# Altium schematic sheet Sheet2.SchDoc
size A3
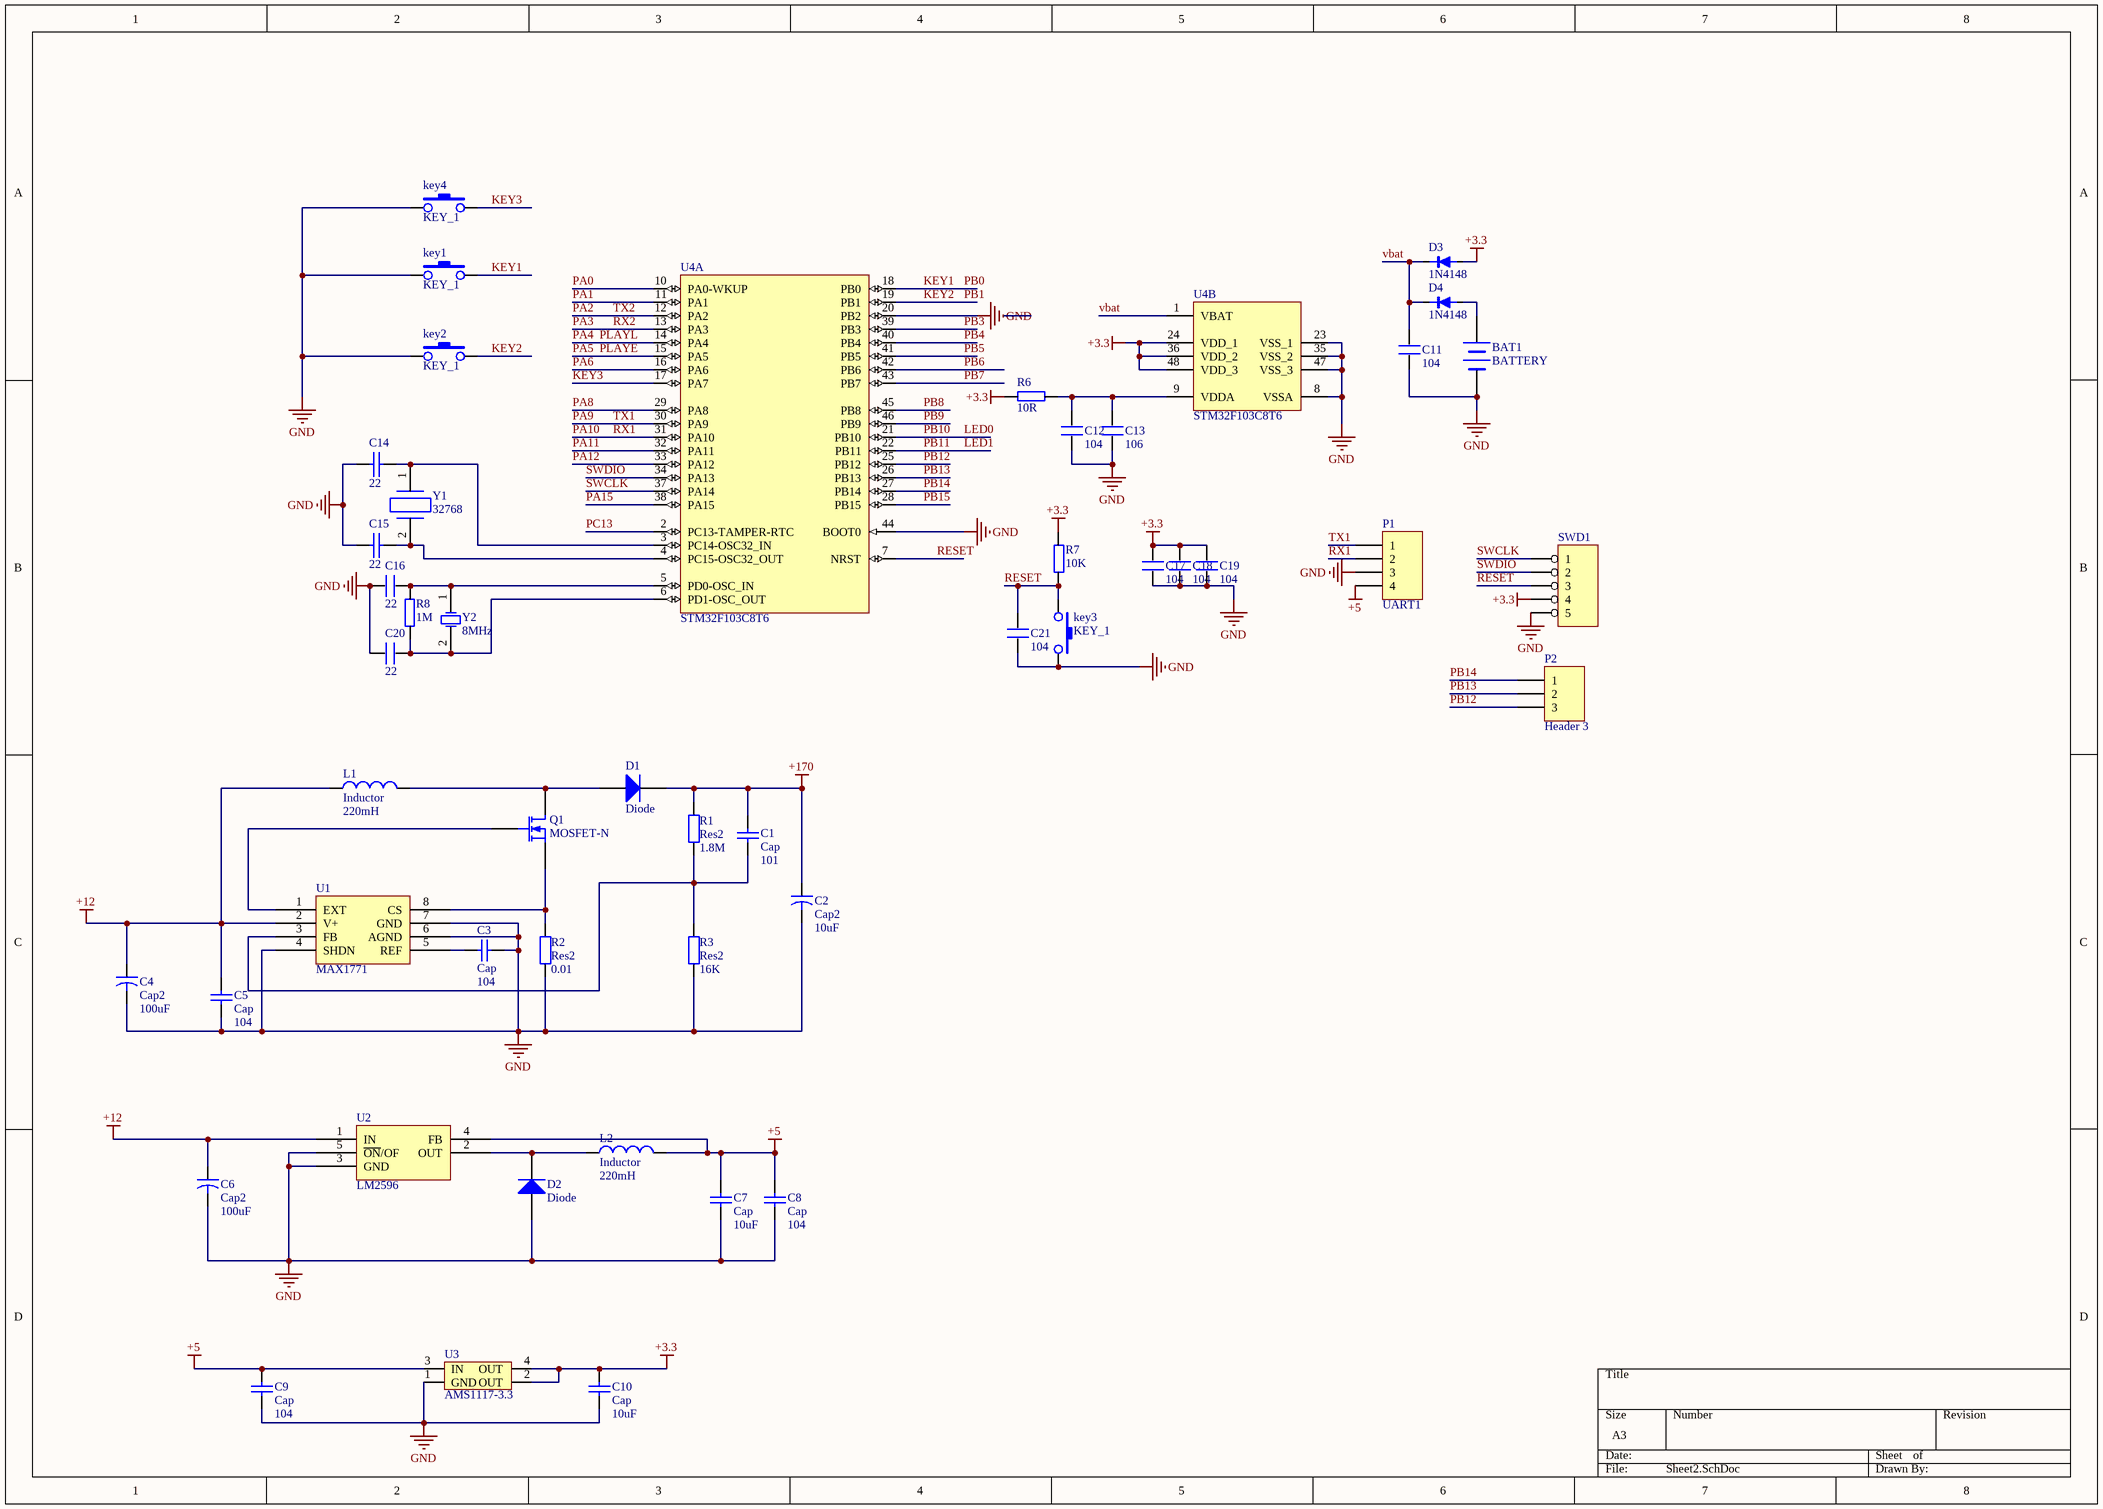
[diagram p0: Sheet2.SchDoc]

## Parts
BAT1  BATTERY  [CR1220]
C1  Cap  value 101  [1206C]
C2  Cap2  value 10uF  [C10x16]
C3  Cap  value 104  [0805-0c]
C4  Cap2  value 100uF  [C5X8]
C5  Cap  value 104  [0805-0c]
C6  Cap2  value 100uF  [C5X8]
C7  Cap  value 10uF  [0805-0c]
C8  Cap  value 104  [0805-0c]
C9  Cap  value 104  [0805-0c]
C10  Cap  value 10uF  [0805-0c]
C11  104  [0805-0c]
C12  104  [0805-0c]
C13  106  [0805-0c]
C14  22  [0805-0c]
C15  22  [0805-0c]
C16  22  [0805-0c]
C17  104  [0805-0c]
C18  104  [0805-0c]
C19  104  [0805-0c]
C20  22  [0805-0c]
C21  104  [0805-0c]
D1  Diode  [DO-214]
D2  Diode  [DO-214]
D3  1N4148  [DO-214]
D4  1N4148  [DO-214]
key1  KEY_1  [KEY-DIP4W]
key2  KEY_1  [KEY-DIP4W]
key3  KEY_1  [KEY-SMD1]
key4  KEY_1  [KEY-DIP4W]
L1  Inductor  value 220mH  [L7X7]
L2  Inductor  value 220mH  [L7X7]
P1  UART1  [HDR1X4]
P2  Header 3  [HDR1X3]
Q1  MOSFET-N  [TO-263-3]
R1  Res2  value 1.8M  [0805-0r]
R2  Res2  value 0.01  [0805-0r]
R3  Res2  value 16K  [0805-0r]
R6  10R  [0805-0r]
R7  10K  [0805-0r]
R8  1M  [0805-0r]
SWD1  HEADER 5  [HDR1X5]  (value not drawn)
U1  MAX1771  [sop8]
U2  LM2596  [TO263-5]
U3  AMS1117-3.3  [SOT-223]
U4  STM32F103C8T6  [STM-LQFP48_N]  (parts A,B of 2)
Y1  32768  [XTAL3X8]
Y2  8MHz  [XTAL-49S-DIP]

## Nets
+3.3: C10.2 C17.2 C18.2 C19.2 D3.1(A) R6.2 R7.2 SWD1.4 U3.2(OUT) U3.4(OUT) U4.24(VDD_1) U4.36(VDD_2) U4.48(VDD_3)
+5: C7.2 C8.2 C9.2 L2.2 P1.4 U2.4(FB) U3.3(IN)
+12: C4.1 C5.2 C6.1 L1.1 U1.2(V+) U2.1(IN)
+170: C1.2 C2.1 D1.2(K) R1.2
GND: BAT1.2(-) C2.2 C3.2 C4.2 C5.1 C6.2 C7.1 C8.1 C9.1 C10.1 C11.1 C12.1 C13.1 C14.1 C15.1 C16.1 C17.1 C18.1 C19.1 C20.1 C21.2 D2.1(A) key1.1 key2.1 key3.2 key4.1 P1.3 R2.1 R3.1 SWD1.5 U1.4(SHDN) U1.6(AGND) U1.7(GND) U2.3(GND) U2.5(~{ON}/OF) U3.1(GND) U4.8(VSSA) U4.20(PB2) U4.23(VSS_1) U4.35(VSS_2) U4.44(BOOT0) U4.47(VSS_3)
KEY1: key1.2 U4.18(PB0)  [also labelled PB0]
KEY2: key2.2 U4.19(PB1)  [also labelled PB1]
KEY3: key4.2 U4.17(PA7)
LED0: U4.21(PB10)  [also labelled PB10]
LED1: U4.22(PB11)  [also labelled PB11]
PA0: U4.10(PA0-WKUP)
PA1: U4.11(PA1)
PA2: U4.12(PA2)  [also labelled TX2]
PA3: U4.13(PA3)  [also labelled RX2]
PA4: U4.14(PA4)  [also labelled PLAYL]
PA5: U4.15(PA5)  [also labelled PLAYE]
PA6: U4.16(PA6)
PA8: U4.29(PA8)
PA9: P1.1 U4.30(PA9)  [also labelled TX1]
PA10: P1.2 U4.31(PA10)  [also labelled RX1]
PA11: U4.32(PA11)
PA12: U4.33(PA12)
PA15: U4.38(PA15)
PB3: U4.39(PB3)
PB4: U4.40(PB4)
PB5: U4.41(PB5)
PB6: U4.42(PB6)
PB7: U4.43(PB7)
PB8: U4.45(PB8)
PB9: U4.46(PB9)
PB12: P2.3 U4.25(PB12)
PB13: P2.2 U4.26(PB13)
PB14: P2.1 U4.27(PB14)
PB15: U4.28(PB15)
PC13: U4.2(PC13-TAMPER-RTC)
RESET: C21.1 key3.1 R7.1 SWD1.3 U4.7(NRST)
SWCLK: SWD1.1 U4.37(PA14)
SWDIO: SWD1.2 U4.34(PA13)
vbat: C11.2 D3.2(K) D4.2(K) U4.1(VBAT)
NetBAT1_1: BAT1.1(+) D4.1(A)
NetC1_1: C1.1 R1.1 R3.2 U1.3(FB)
NetC3_1: C3.1 U1.5(REF)
NetC12_2: C12.2 C13.2 R6.1 U4.9(VDDA)
NetC14_2: C14.2 U4.3(PC14-OSC32_IN) Y1.1
NetC15_2: C15.2 U4.4(PC15-OSC32_OUT) Y1.2
NetC16_2: C16.2 R8.1 U4.5(PD0-OSC_IN) Y2.1(OSC1)
NetC20_2: C20.2 R8.2 U4.6(PD1-OSC_OUT) Y2.2(OSC2)
NetD1_1: D1.1(A) L1.2 Q1.1(D)
NetD2_2: D2.2(K) L2.1 U2.2(OUT)
NetQ1_2: Q1.2(G) U1.1(EXT)
NetQ1_3: Q1.3(S) R2.2 U1.8(CS)

## Library data of the parts
BAT1 = BATTERY: pin to pad: 1>2 2>1
C1 C3 C5 C7-C10 = Cap: Capacitor; Published: 8-Jun-2000; LatestRevisionDate: 17-Jul-2002; LatestRevisionNote: Re-released for DXP Platform.; PackageReference: RAD-0.3; Publisher: Altium Limited; PackageDescription: Radial Cap, Thru-Hole; 2 Leads; 0.3 in Pin Spacing
C2 C4 C6 = Cap2: Capacitor; Published: 23-Sep-2002; PackageReference: CAPR5-4X5; Publisher: Altium Limited; PackageDescription: Capacitor; 2 Leads
C11-C13 C16-C21 = C
C14 C15 = 普通电容: Capacitor
D1 D2 = Diode: Default Diode; Published: 8-Jun-2000; LatestRevisionDate: 17-Jul-2002; LatestRevisionNote: Re-released for DXP Platform.; PackageVersion: Sep-1996; PackageReference: SMC; Publisher: Altium Limited; PackageDescription: DO-214-AB/SMC; 2 C-Bend Leads; Body 7.9 x 5.9 mm, inc. leads (LxW); Code_JEDEC: DO-214-AB
D3 D4 = DIODE1
L1 L2 = Inductor: Code_IEC: 1005; Published: 8-Jun-2000; LatestRevisionDate: 29-May-2009; LatestRevisionNote: IPC-7351 Footprint Added.; PackageReference: 0402-A; Publisher: Altium Limited; PackageDescription: Chip Inductor; Code_JEITA: 0402
P1 = Header 4: Header, 4-Pin; LatestRevisionDate: 17-Jul-2002; LatestRevisionNote: Re-released for DXP Platform.; Publisher: Altium Limited
P2 = Header 3: Header, 3-Pin; LatestRevisionDate: 17-Jul-2002; LatestRevisionNote: Re-released for DXP Platform.; Publisher: Altium Limited
Q1 = MOSFET-N: N-Channel MOSFET; pin to pad: 1>2 2>1; Published: 8-Jun-2000; LatestRevisionDate: 17-Jul-2002; LatestRevisionNote: Re-released for DXP Platform.; PackageVersion: 1995/1996; PackageReference: E3; Publisher: Altium Limited; PackageDescription: TO, Flat Index; 3 In-Line, Axial Leads; Body Dia. 4.6mm; Lead Dia. 0.5 mm (max)
R1-R3 = Res2: Resistor; Published: 8-Jun-2000; LatestRevisionDate: 17-Jul-2002; LatestRevisionNote: Re-released for DXP Platform.; PackageReference: AXIAL-0.4; Publisher: Altium Limited; PackageDescription: Axial Device, Thru-Hole; 2 Leads; 0.4 in Pin Spacing
R6-R8 = R
U1 U2 = Component_1
U3 = AMS1117
U4 = STM32F103C8T6: ARM Cortex-M3 32-bit MCU, 64 KB Flash, 20 KB Internal RAM, 37 I/Os, 48-pin LQFP, -40 to 85 degC, Tray; A/D Converter: 2x12-bit (10 Channel); FLASH Size (Prog) (kB): 64; I/Os (High Current): 37; Internal RAM Size (kB): 20; Operating Frequency(F) (Processor speed) (MHz): 72; Supply Voltage(Vcc) min (V): 2; DatasheetVersion: Rev. 16; PackageVersion: Rev. 6, 06/2013; PackageReference: LQFP48; PackageDescription: 48-Pin Low Profile Quad Flat Package, 7 x 7 mm Body, 0.5 mm Pitch; Supplier 1: Digi-Key; Supplier Part Number 1: 497-6063-ND; Supplier 2: Farnell; Supplier Part Number 2: 1447637; Supplier 3: Newark; Supplier Part Number 3: 59M2182; Supplier 4: Newark; Supplier Part Number 4: 57P1222; Supplier 5: Mouser; Supplier Part Number 5: 511-STM32F103C8T6; Core: ARM Cortex-M3; Packing: Tray; Mounting Technology: Surface Mount; PartNumber: STM32F103C8T6; ComponentLink1Description: Manufacturer URL; ComponentLink1URL: http://www.st.com/web/en/home.html; ComponentLink2Description: Datasheet; ComponentLink2URL: http://www.st.com/st-web-ui/static/active/en/resource/technical/document/datasheet/CD00161566.pdf; ComponentLink3Description: Package Specification; ComponentLink3URL: http://www.st.com/st-web-ui/static/active/en/resource/technical/document/datasheet/DM00058181.pdf
Y1 = XTAL
Y2 = XTAL: Crystal Oscillator; Published: 8-Jun-2000; LatestRevisionDate: 17-Jul-2002; LatestRevisionNote: Re-released for DXP Platform.; Publisher: Altium Limited